# EAGLE design ISPbreadboardAdapter_ATmega328compatible (EAGLE 6.6.0)
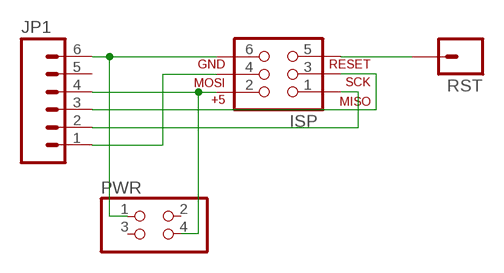
[diagram p0: schematic, sheet 1]

## Parts
ISP  AVR_SPI_PRG_6PTH  [2X3]
JP1  M06SILK_FEMALE_PTH  [1X06]
PWR  PINHD-2X2  [2X02]
RST  M01PTH  [1X01]

## Nets
GND: ISP.6 JP1.6 PWR.1
MISO: ISP.1 JP1.2
MOSI: ISP.4 JP1.1
RST: ISP.5 RST.1
SCK: ISP.3 JP1.3
VCC: ISP.2 JP1.4 PWR.4
Unconnected: JP1.5 PWR.2 PWR.3

## Library data of the parts
ISP = SparkFun-Connectors:AVR_SPI_PRG_6: AVR ISP 6 Pin This is the reduced ISP connector for AVR programming. Common on Arduino. This footprint will take up less PCB space and can be used with a 10-pin to 6-pin adapter such as SKU: BOB-08508 **Special note about "TEST_POINT" package. The stop mask is on the top side, so if you want your programming test points to be on the bottom of your board, make sure to place this package on the bottom side of the board. This also ensure that the orientation to program from the bottom side will be correct.
JP1 = SparkFun-Connectors:M06: Header 6 Standard 6-pin 0.1" header. Use with straight break away headers (SKU : PRT-00116), right angle break away headers (PRT-00553), swiss pins (PRT-00743), machine pins (PRT-00117), and female headers (PRT-00115). Molex polarized connector foot print use with SKU : PRT-08094 with associated crimp pins and housings. NOTES ON THE VARIANTS LOCK and LOCK_LONGPADS... This footprint was designed to help hold the alignment of a through-hole component (i.e. 6-pin header) while soldering it into place. You may notice that each hole has been shifted either up or down by 0.005 of an inch from it's more standard position (which is a perfectly straight line). This slight alteration caused the pins (the squares in the middle) to touch the edges of the holes. Because they are alternating, it causes a "brace" to hold the component in place. 0.005 has proven to be the perfect amount of "off-center" position when using our standard breakaway headers. Although looks a little odd when you look at the bare footprint, once you have a header in there, the alteration is very hard to notice. Also,if you push a header all the way into place, it is covered up entirely on the bottom side. This idea of altering the position of holes to aid alignment will be further integrated into the Sparkfun Library for other footprints. It can help hold any component with 3 or more connection pins.; PROD_ID: CONN-08437
PWR = pinhead:PINHD-2X2: PIN HEADER
RST = SparkFun-Connectors:M01: Header 1 Standard 1-pin 0.1" header. Use with straight break away headers (SKU : PRT-00116), right angle break away headers (PRT-00553), swiss pins (PRT-00743), machine pins (PRT-00117), and female headers (PRT-00115).

## Board
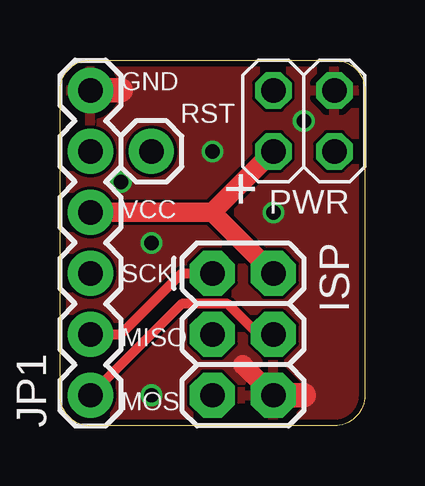
[diagram p1: board, top side]
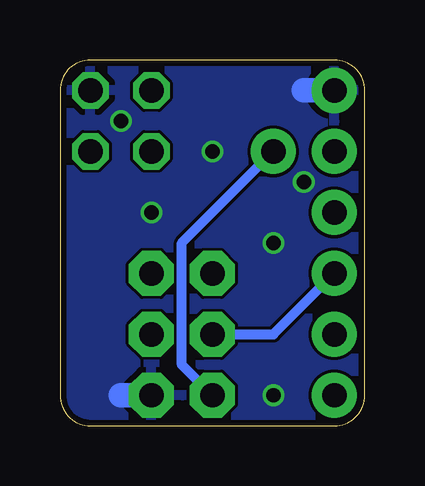
[diagram p2: board, bottom side, seen from below]

Size 12.7 x 15.24 mm. Coordinates in mm from the lower left corner, seen from the top.
Outline: 0,1.27 0,13.97 arc-90 1.27,15.24 11.43,15.24 arc-90 12.7,13.97 12.7,1.27 arc-90 11.43,0 1.27,0 arc-90 0,1.27
Copper layers (1*16): Top 0.035mm / dielectric 1.5mm / Bottom 0.035mm
Design rules "dirt_cheap_dirty_boards.v1": minimum track width 5mil, minimum drill 12mil, track to track 5mil, track to pad 5mil, pad to pad 5mil, via to via 5mil, smd to smd 0mil, copper to edge 10mil, drill to drill 10mil, minimum pad ring 10mil, minimum via ring 6mil, stop-mask expansion 2mil, vias tented up to drill 25mil, thermal gap 10mil

### Footprints (pad centres in the part's own frame; a part is rotated, then mirrored left to right if it is on the bottom)
2X3 = drill 1.016 pad 1.88 octagon: 1 0,0; 2 0,2.54; 3 2.54,0; 4 2.54,2.54; 5 5.08,0; 6 5.08,2.54
1X06 = drill 1.016 pad 1.88: 1 0,0; 2 2.54,0; 3 5.08,0; 4 7.62,0; 5 10.16,0; 6 12.7,0
2X02 = drill 1.016 octagon: 1 -1.27,-1.27; 2 -1.27,1.27; 3 1.27,-1.27; 4 1.27,1.27
1X01 = drill 1.016 pad 1.88: 1 0,0

### Placement (x,y rotation side)
ISP  6.35,6.35 270 top
JP1  1.27,1.27 90 top
PWR  10.16,12.7 180 top
RST  3.81,11.43 0 top

### Tracks (layer width: path | path; a pad name or v marks a point on that pad's centre or on a via)
GND  (via drill 0.6)
  Top 0.813: ISP.6 7.62,2.54
  Top 1.016: JP1.6 2.54,13.97 | ISP.6 10.16,1.27
  Bottom 1.016: ISP.6 10.16,1.27 | JP1.6 2.54,13.97
  other vias: 3.81,7.62 3.81,1.27 6.35,11.43 8.89,8.89 2.54,10.16 10.16,12.7
  pour Top: 0,0 12.7,0 12.7,15.24 0,15.24
  pour Bottom: 0,15.24 0,0 12.7,0 12.7,15.24
MISO
  Top 0.406: JP1.2 2.54,3.81 5.08,6.35 ISP.1
MOSI
  Top 0.406: ISP.4 8.26,3.81 6.99,5.08 5.08,5.08 JP1.1
RST
  Bottom 0.406: ISP.5 7.62,2.54 7.62,7.62 RST.1
SCK
  Bottom 0.406: ISP.3 3.81,3.81 JP1.3
VCC
  Top 0.813: JP1.4 6.35,8.89 | 6.35,8.89 ISP.2 | 6.35,8.89 PWR.4

### Text on the board
tNames: + | GND / / VCC / SCK / MISO / MOSI